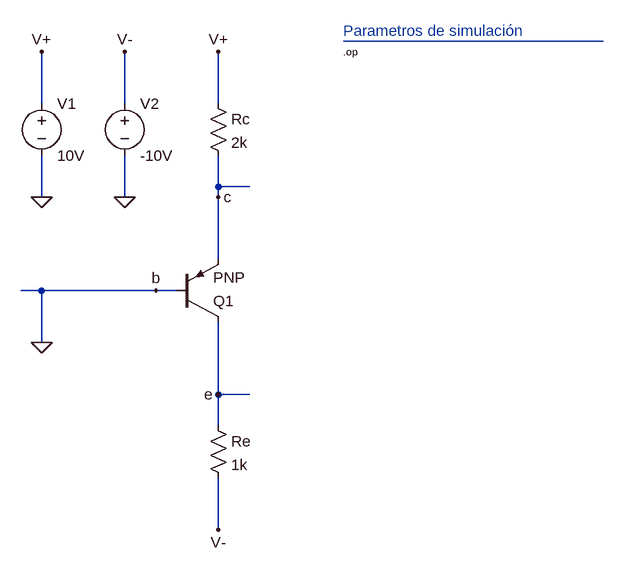
[diagram p0: schematic ejemplo_5-7.asc]
ejemplo_5-7.asc, the LTspice schematic file:
Version 4
SHEET 1 1376 680
WIRE -304 -240 -304 -320
WIRE -176 -240 -176 -320
WIRE -32 -240 -32 -320
WIRE -32 -112 -32 -160
WIRE 16 -112 -32 -112
WIRE -304 -96 -304 -160
WIRE -176 -96 -176 -160
WIRE -32 -96 -32 -112
WIRE -32 0 -32 -96
WIRE -304 48 -336 48
WIRE -128 48 -304 48
WIRE -96 48 -128 48
WIRE -304 128 -304 48
WIRE -32 208 -32 96
WIRE 16 208 -32 208
WIRE -32 256 -32 208
WIRE -32 416 -32 336
FLAG -304 -96 0
FLAG -32 -96 c
FLAG -32 208 e
FLAG -128 48 b
FLAG -304 -320 V+
FLAG -32 -320 V+
FLAG -304 128 0
FLAG -176 -96 0
FLAG -176 -320 V-
FLAG -32 416 V-
DATAFLAG -336 48 ""
DATAFLAG 16 208 ""
DATAFLAG 16 -112 ""
DATAFLAG -192 80 "Ib(Q1)"
DATAFLAG 64 144 "I(Re)"
DATAFLAG 64 -32 "Ic(Q1)"
SYMBOL res -48 -256 R0
SYMATTR InstName Rc
SYMATTR Value 2k
SYMBOL res -48 240 R0
SYMATTR InstName Re
SYMATTR Value 1k
SYMBOL voltage -304 -256 R0
WINDOW 123 0 0 Left 0
WINDOW 39 0 0 Left 0
SYMATTR InstName V1
SYMATTR Value 10V
SYMBOL voltage -176 -256 R0
WINDOW 123 0 0 Left 0
WINDOW 39 0 0 Left 0
SYMATTR InstName V2
SYMATTR Value -10V
SYMBOL pnp -96 96 M180
SYMATTR InstName Q1
TEXT 160 -352 Left 2 ;Parametros de simulación
TEXT 160 -320 Left 1 !.op
LINE Normal 560 -336 160 -336
LINE Normal 560 -336 560 -336 2
LINE Normal 560 -336 560 -336 2

The netlist it stands for:
* ejemplo_5-7.asc
Rc V+ c 2k
Re e V- 1k
V1 V+ 0 10V
V2 V- 0 -10V
Q1 e 0 c 0 PNP
.model NPN NPN
.model PNP PNP
.lib standard.bjt
* Parametros de simulación
.op
.backanno
.end